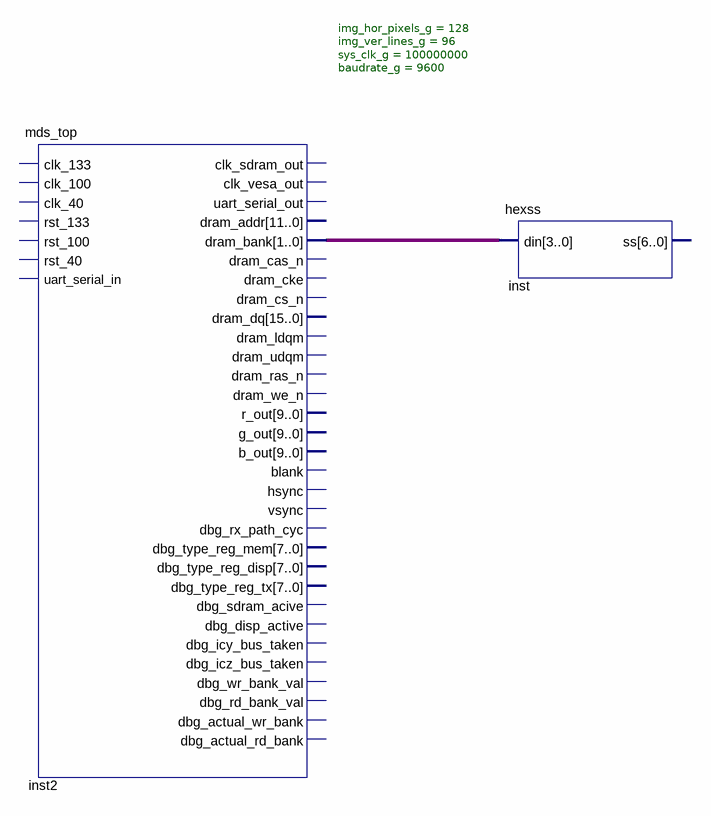
[diagram p0: schematic sheet]
// Quartus schematic mds_img_manipulation.bdf as structural Verilog: 2 symbols, 0 pins
module mds_img_manipulation (
);

  wire [3:0] inst2_dram_bank;

  mds_top #(.img_hor_pixels_g(128), .img_ver_lines_g(96), .sys_clk_g(100000000), .baudrate_g(9600)) inst2 (.dram_bank(inst2_dram_bank));  // open: clk_133, clk_100, clk_40, rst_133, rst_100, rst_40, uart_serial_in, clk_sdram_out, clk_vesa_out, uart_serial_out, dram_addr, dram_cas_n, dram_cke, dram_cs_n, dram_ldqm, dram_udqm, dram_ras_n, dram_we_n, r_out, g_out, b_out, blank, hsync, vsync, dbg_rx_path_cyc, dbg_type_reg_mem, dbg_type_reg_disp, dbg_type_reg_tx, dbg_sdram_acive, dbg_disp_active, dbg_icy_bus_taken, dbg_icz_bus_taken, dbg_wr_bank_val, dbg_rd_bank_val, dbg_actual_wr_bank, dbg_actual_rd_bank, dram_dq
  hexss inst (.din(inst2_dram_bank));  // open: ss
endmodule
